# Altium schematic sheet Oscillator.SchDoc
size A4; SheetNumber: 3; SheetTotal: 5
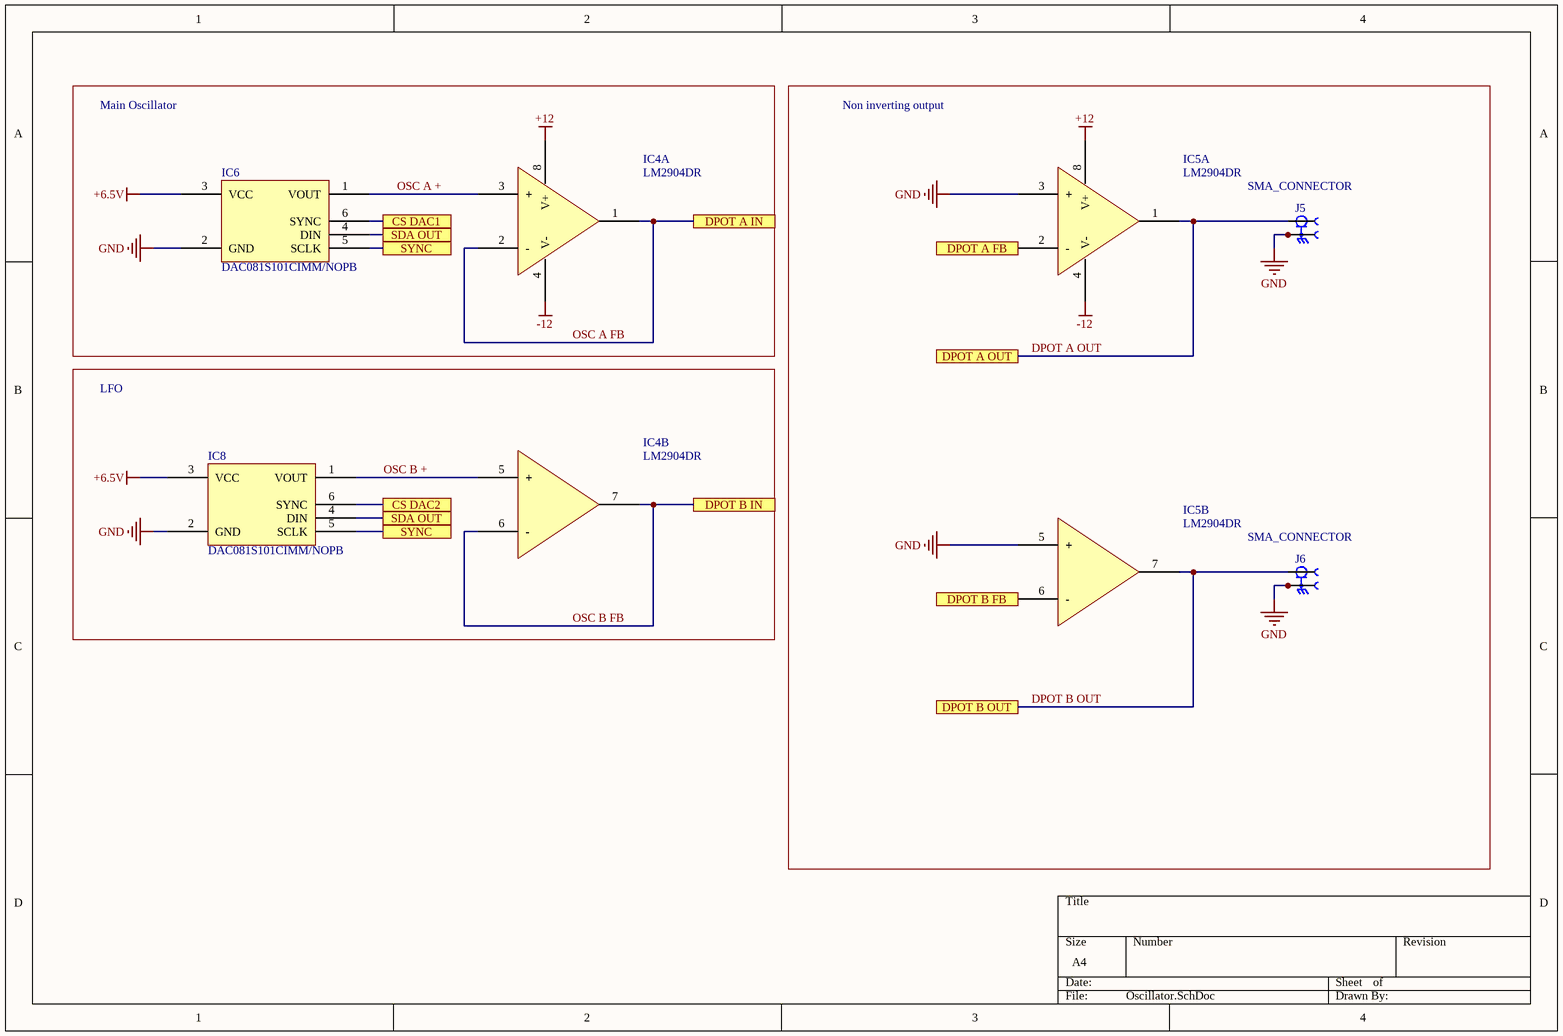
[diagram p0: Oscillator.SchDoc]

## Parts
IC4  LM2904DR  [TI SOIC-8 D]  (parts A,B of 2)
IC5  LM2904DR  [TI SOIC-8 D]  (parts A,B of 2)
IC6  DAC081S101CIMM/NOPB  [TI VSSOP-8 DGK]
IC8  DAC081S101CIMM/NOPB  [TI VSSOP-8 DGK]
J5  SMA_CONNECTOR  [LPRS_SMA_CONNECTOR]
J6  SMA_CONNECTOR  [LPRS_SMA_CONNECTOR]

## Blocks framed on the sheet
Main Oscillator: IC4 IC6
Non inverting output: IC5 J5 J6
LFO: IC4 IC8

## Ports
CS DAC1, CS DAC2, DPOT A FB, DPOT A IN, DPOT A OUT, DPOT B FB, DPOT B IN, DPOT B OUT, SDA OUT, SYNC

## Nets
+6.5V: IC6.3(VCC) IC8.3(VCC)
+12: IC4.8(V+) IC5.8(V+)
-12: IC4.4(V-) IC5.4(V-)
GND: IC5.3(+) IC5.5(+) IC6.2(GND) IC8.2(GND) J5.G1 J5.G2 J5.G3 J5.G4 J6.G1 J6.G2 J6.G3 J6.G4
CS DAC1: IC6.6(SYNC) ; port CS DAC1
CS DAC2: IC8.6(SYNC) ; port CS DAC2
DPOT A FB: IC5.2(-) ; port DPOT A FB
DPOT A OUT: IC5.1(OUTA) J5.1 ; port DPOT A OUT
DPOT B FB: IC5.6(-) ; port DPOT B FB
DPOT B OUT: IC5.7(OUTB) J6.1 ; port DPOT B OUT
OSC A +: IC4.3(+) IC6.1(VOUT)
OSC A FB: IC4.1(OUTA) IC4.2(-) ; port DPOT A IN
OSC B +: IC4.5(+) IC8.1(VOUT)
OSC B FB: IC4.6(-) IC4.7(OUTB) ; port DPOT B IN
SDA OUT: IC6.4(DIN) IC8.4(DIN) ; port SDA OUT
SYNC: IC6.5(SCLK) IC8.5(SCLK) ; port SYNC

## Library data of the parts
IC4 IC5 = LM2904DR: IC OPAMP GP 2 CIRCUIT 8SOIC; Manufacturer: Texas Instruments; Amplifier Type: General Purpose; Current - Input Bias: 20nA; Current - Output / Channel: 30mA; Current - Supply: 1mA; Gain Bandwidth Product: 700kHz; Number of Circuits: 2; Slew Rate: 0.3V/µs; Voltage - Input Offset: 3mV; Voltage - Supply, Single/Dual (±): 3V ~ 26V, ±1.5V ~ 13V; Part Number: LM2904DR; ComponentLink1Description: Datasheet; ComponentLink1URL: http://www.ti.com/general/docs/suppproductinfo.tsp?distId=10&gotoUrl=http%3A%2F%2Fwww.ti.com%2Flit%2Fgpn%2Flm258a; ComponentLink2Description: DigiKey Link; ComponentLink2URL: http://digikey.com/product-detail/en/texas-instruments/LM2904DR/296-14596-1-ND/555533; Device Package: 8-SOIC (0.154", 3.90mm Width); LastUpdated: 9/01/2020 2:06:28 AM; Lifecycle Status: Active; Minimum Order: 1; Mounting Type: Surface Mount; Operating Temperature: -40°C ~ 125°C; Package / Case: 8-SOIC (0.154", 3.90mm Width); Packaging: ReReel; PartId: 4; Part Status: Active; Price: 0.00; Series: -; Supplier 1: DigiKey; Supplier Part Number 1: 296-14596-1-ND; Supplier Device Package: 8-SOIC
IC6 IC8 = DAC081S101CIMM/NOPB: IC DAC 8BIT V-OUT 8VSSOP; Part Number: DAC081S101CIMM/NOPB
J5 J6 = SMA_CONNECTOR: Straight SMA Connector; MP: altium_native_batch; Value: *; Package: None; Availability: Unavailable; Price: None